# EAGLE design schematic (EAGLE 6.2)
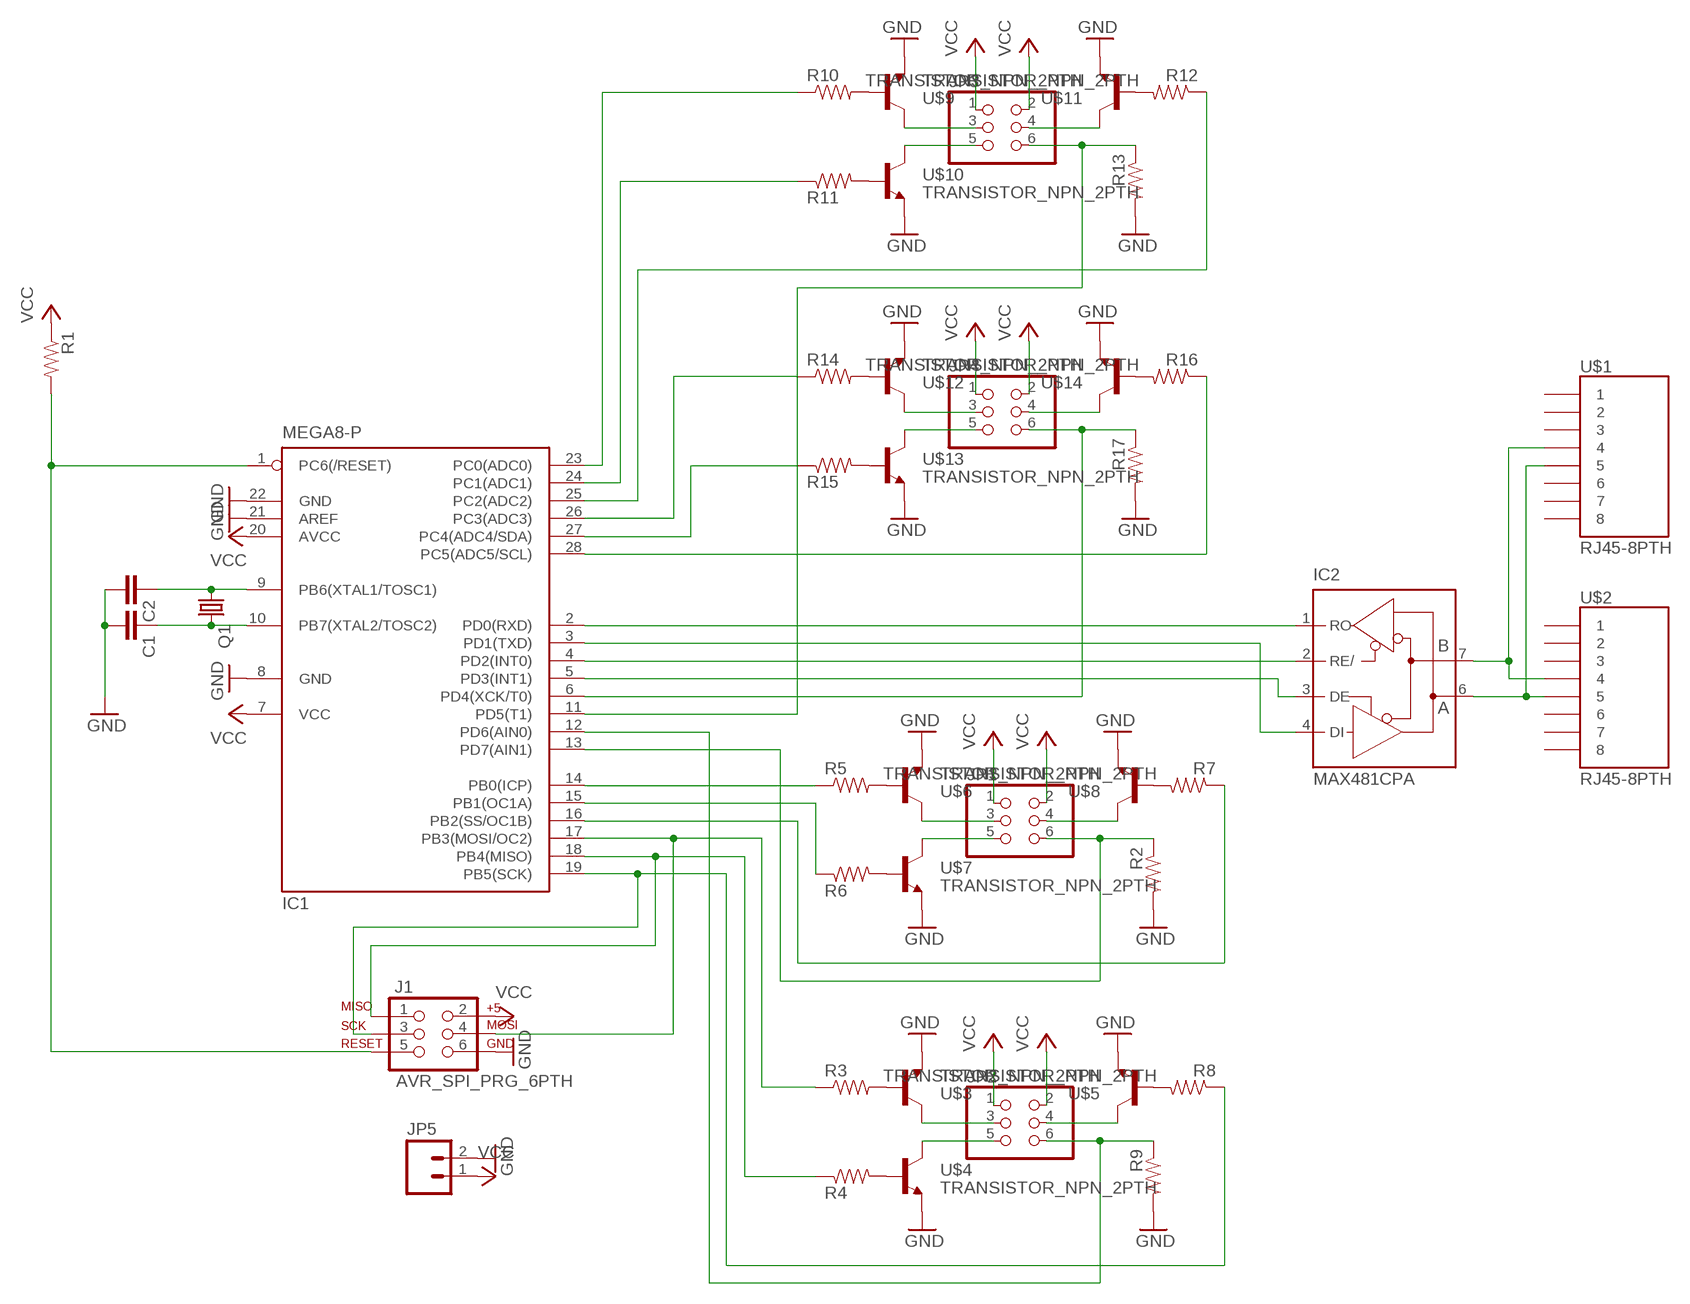
[diagram p0: schematic, sheet 1]

## Parts
C1  CAPKIT  [CAP-PTH-SMALL-KIT]
C2  CAPKIT  [CAP-PTH-SMALL-KIT]
IC1  MEGA8-P  [DIL28-3]
IC2  MAX481CPA  [DIL08]
J1  AVR_SPI_PRG_6PTH  [2X3]
JP1  PINHD-2X3  [2X03]
JP2  PINHD-2X3  [2X03]
JP3  PINHD-2X3  [2X03]
JP4  PINHD-2X3  [2X03]
JP5  M023.5MM  [SCREWTERMINAL-3.5MM-2]
Q1  CRYSTALHC49U-V  [HC49U-V]
R1  RESISTORPTH-1/4W  [AXIAL-0.4]
R2  RESISTORPTH-1/4W  [AXIAL-0.4]
R3  RESISTORPTH-1/4W  [AXIAL-0.4]
R4  RESISTORPTH-1/4W  [AXIAL-0.4]
R5  RESISTORPTH-1/4W  [AXIAL-0.4]
R6  RESISTORPTH-1/4W  [AXIAL-0.4]
R7  RESISTORPTH-1/4W  [AXIAL-0.4]
R8  RESISTORPTH-1/4W  [AXIAL-0.4]
R9  RESISTORPTH-1/4W  [AXIAL-0.4]
R10  RESISTORPTH-1/4W  [AXIAL-0.4]
R11  RESISTORPTH-1/4W  [AXIAL-0.4]
R12  RESISTORPTH-1/4W  [AXIAL-0.4]
R13  RESISTORPTH-1/4W  [AXIAL-0.4]
R14  RESISTORPTH-1/4W  [AXIAL-0.4]
R15  RESISTORPTH-1/4W  [AXIAL-0.4]
R16  RESISTORPTH-1/4W  [AXIAL-0.4]
R17  RESISTORPTH-1/4W  [AXIAL-0.4]
U$1  RJ45-8PTH  [RJ45-8]
U$2  RJ45-8PTH  [RJ45-8]
U$3  TRANSISTOR_NPN_2PTH  [TO-92]
U$4  TRANSISTOR_NPN_2PTH  [TO-92]
U$5  TRANSISTOR_NPN_2PTH  [TO-92]
U$6  TRANSISTOR_NPN_2PTH  [TO-92]
U$7  TRANSISTOR_NPN_2PTH  [TO-92]
U$8  TRANSISTOR_NPN_2PTH  [TO-92]
U$9  TRANSISTOR_NPN_2PTH  [TO-92]
U$10  TRANSISTOR_NPN_2PTH  [TO-92]
U$11  TRANSISTOR_NPN_2PTH  [TO-92]
U$12  TRANSISTOR_NPN_2PTH  [TO-92]
U$13  TRANSISTOR_NPN_2PTH  [TO-92]
U$14  TRANSISTOR_NPN_2PTH  [TO-92]

## Nets
GND: C1.2 C2.2 IC1.8(GND) IC1.21(AREF) IC1.22(GND) J1.6 JP5.2 R2.P$2 R9.P$2 R13.P$2 R17.P$2 U$3.3(E) U$4.3(E) U$5.3(E) U$6.3(E) U$7.3(E) U$8.3(E) U$9.3(E) U$10.3(E) U$11.3(E) U$12.3(E) U$13.3(E) U$14.3(E)
N$1: IC2.7(B) U$1.4 U$2.4
N$2: IC2.6(A) U$1.5 U$2.5
N$3: IC1.26(PC3(ADC3)) R14.P$1
N$4: C2.1 IC1.9(PB6(XTAL1/TOSC1)) Q1.1
N$5: C1.1 IC1.10(PB7(XTAL2/TOSC2)) Q1.2
N$6: JP1.3 U$6.1(C)
N$7: IC1.2(PD0(RXD)) IC2.1(RO)
N$8: IC1.3(PD1(TXD)) IC2.4(DI)
N$9: JP1.5 U$7.1(C)
N$10: JP1.4 U$8.1(C)
N$11: IC1.27(PC4(ADC4/SDA)) R15.P$1
N$12: IC1.14(PB0(ICP)) R5.P$1
N$13: IC1.15(PB1(OC1A)) R6.P$1
N$14: IC1.13(PD7(AIN1)) JP1.6 R2.P$1
N$16: IC1.5(PD3(INT1)) IC2.3(DE)
N$17: R5.P$2 U$6.2(B)
N$18: IC1.1(PC6(/RESET)) J1.5 R1.P$2
N$19: R6.P$2 U$7.2(B)
N$20: R7.P$2 U$8.2(B)
N$21: IC1.12(PD6(AIN0)) JP2.6 R9.P$1
N$22: IC1.4(PD2(INT0)) IC2.2(RE/)
N$23: R3.P$2 U$3.2(B)
N$24: R4.P$2 U$4.2(B)
N$25: R8.P$2 U$5.2(B)
N$26: IC1.19(PB5(SCK)) J1.3 R8.P$1
N$27: IC1.16(PB2(SS/OC1B)) R7.P$1
N$28: JP2.3 U$3.1(C)
N$29: JP2.5 U$4.1(C)
N$30: JP2.4 U$5.1(C)
N$31: IC1.11(PD5(T1)) JP3.6 R13.P$1
N$32: R10.P$2 U$9.2(B)
N$33: R11.P$2 U$10.2(B)
N$34: R12.P$2 U$11.2(B)
N$35: IC1.24(PC1(ADC1)) R11.P$1
N$36: IC1.25(PC2(ADC2)) R12.P$1
N$39: JP3.3 U$9.1(C)
N$40: JP3.5 U$10.1(C)
N$41: JP3.4 U$11.1(C)
N$42: IC1.6(PD4(XCK/T0)) JP4.6 R17.P$1
N$43: R14.P$2 U$12.2(B)
N$45: R15.P$2 U$13.2(B)
N$47: R16.P$2 U$14.2(B)
N$48: IC1.23(PC0(ADC0)) R10.P$1
N$50: IC1.28(PC5(ADC5/SCL)) R16.P$1
N$51: JP4.3 U$12.1(C)
N$52: JP4.5 U$13.1(C)
N$53: JP4.4 U$14.1(C)
N$54: IC1.17(PB3(MOSI/OC2)) J1.4 R3.P$1
N$55: IC1.18(PB4(MISO)) J1.1 R4.P$1
VCC: IC1.7(VCC) IC1.20(AVCC) J1.2 JP1.1 JP1.2 JP2.1 JP2.2 JP3.1 JP3.2 JP4.1 JP4.2 JP5.1 R1.P$1
Unconnected: U$1.1 U$1.2 U$1.3 U$1.6 U$1.7 U$1.8 U$2.1 U$2.2 U$2.3 U$2.6 U$2.7 U$2.8

## Power pins joined to a net without a drawn wire
GND: IC2.5(GND)
VCC: IC2.8(VCC)

## Library data of the parts
C1 C2 = SparkFun-Passives:CAP: Capacitor Standard 0603 ceramic capacitor, and 0.1" leaded capacitor.
IC1 = atmel:MEGA8-P: MICROCONTROLLER 8 Kbytes FLASH, 1 kbytes SRAM, 512 bytes EEPROM, USART, 4-channel 10 bit ADC, 2-channel 8 bit ADC Pin compatible with Atmega48, ATMega88, ATMega168 Source: avr.lbr; OC_FARNELL: unknown; OC_NEWARK: unknown
IC2 = maxim:MAX481CPA: RS485 TRANSEIVER; MPN: MAX481CPA+; OC_FARNELL: unknown; OC_NEWARK: 99K3445
J1 = SparkFun-Connectors:AVR_SPI_PRG_6: AVR ISP 6 Pin This is the reduced ISP connector for AVR programming. Common on Arduino. This footprint will take up less PCB space and can be used with a 10-pin to 6-pin adapter such as SKU: BOB-08508
JP1-JP4 = SparkFun-Connectors:PINHD-2X3: PIN HEADER
JP5 = SparkFun-Connectors:M02: Header 2 Standard 2-pin 0.1" header. Use with straight break away headers (SKU : PRT-00116), right angle break away headers (PRT-00553), swiss pins (PRT-00743), machine pins (PRT-00117), and female headers (PRT-00115). Molex polarized connector foot print use with SKU : PRT-08233 with associated crimp pins and housings.
Q1 = crystal:CRYSTAL: CRYSTAL; OC_FARNELL: 1666969; OC_NEWARK: unknown
R1-R17 = SparkFun-Passives:RESISTOR: Resistor Basic schematic elements and footprints for 0603, 1206, and PTH resistors.
U$1 U$2 = SparkFun-Connectors:RJ45-8: RJ45 Jack Simple RJ45, 8-pin connection - connector for common Cat5, Cat5e, and Cat6 Ethernet cables. Footprint not yet proven in production. Connector sku is PRT-00643; Breakout PCB sku is BOB-00716.
U$3-U$14 = SparkFun-DiscreteSemi:TRANSISTOR_NPN_2: Alternate TO-92 NPN BJT

## Board
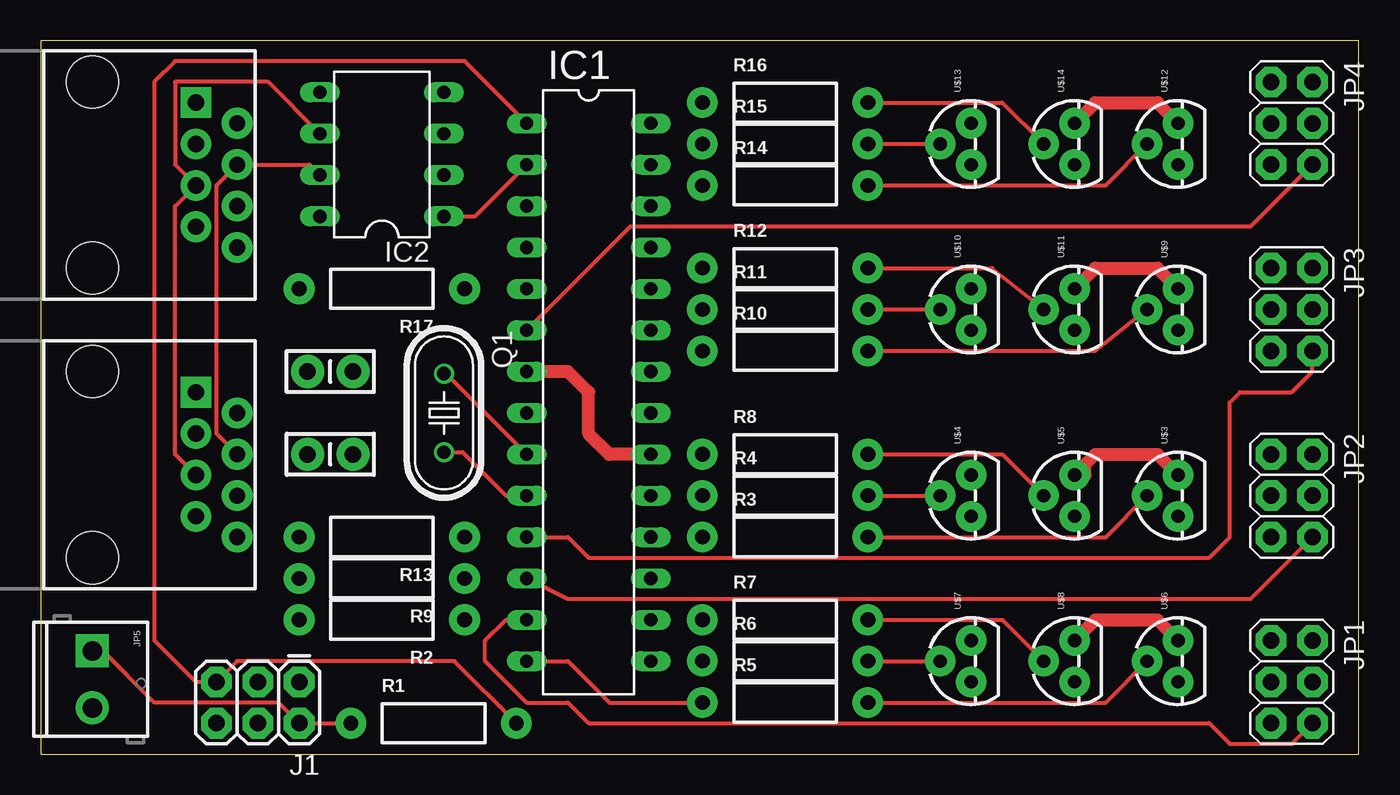
[diagram p1: board, top side]
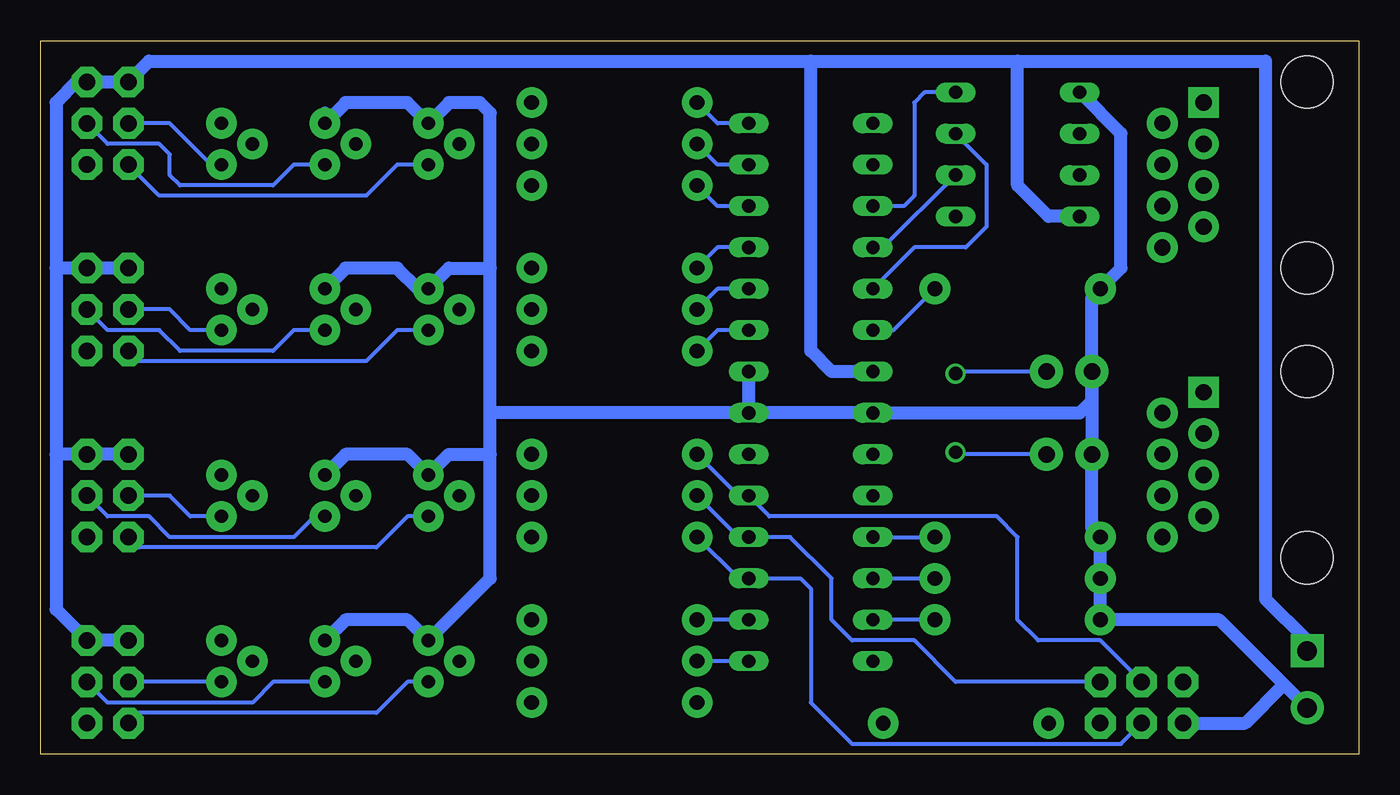
[diagram p2: board, bottom side, seen from below]

Size 80.95 x 43.8 mm. Coordinates in mm from the lower left corner, seen from the top.
Outline: 0,0 80.95,0 80.95,43.8 0,43.8 0,0
Copper layers (1*16): Top 0.0356mm / dielectric 1.5011mm / Bottom 0.0356mm
Design rules: minimum track width 6mil, minimum drill 13mil, track to track 6mil, track to pad 6mil, pad to pad 6mil, via to via 6mil, smd to smd 6mil, copper to edge 15mil, drill to drill 6mil, minimum pad ring 7mil, minimum via ring 7mil, stop-mask expansion 4mil, vias tented up to drill 0mil, thermal gap 10mil

### Footprints (pad centres in the part's own frame; a part is rotated, then mirrored left to right if it is on the bottom)
CAP-PTH-SMALL-KIT = drill 1.016 pad 2.032: 1 -1.397,0; 2 1.397,0
DIL28-3 = drill 0.813 long: 1 -16.51,-3.81; 2 -13.97,-3.81; 3 -11.43,-3.81; 4 -8.89,-3.81; 5 -6.35,-3.81; 6 -3.81,-3.81; 7 -1.27,-3.81; 8 1.27,-3.81; 9 3.81,-3.81; 10 6.35,-3.81; 11 8.89,-3.81; 12 11.43,-3.81; 13 13.97,-3.81; 14 16.51,-3.81; 15 16.51,3.81; 16 13.97,3.81; 17 11.43,3.81; 18 8.89,3.81; 19 6.35,3.81; 20 3.81,3.81; 21 1.27,3.81; 22 -1.27,3.81; 23 -3.81,3.81; 24 -6.35,3.81; 25 -8.89,3.81; 26 -11.43,3.81; 27 -13.97,3.81; 28 -16.51,3.81
DIL08 = drill 0.813 long: 1 -3.81,-3.81; 2 -1.27,-3.81; 3 1.27,-3.81; 4 3.81,-3.81; 5 3.81,3.81; 6 1.27,3.81; 7 -1.27,3.81; 8 -3.81,3.81
2X3 = drill 1.016 pad 1.88 octagon: 1 0,0; 2 0,2.54; 3 2.54,0; 4 2.54,2.54; 5 5.08,0; 6 5.08,2.54
2X03 = drill 1.016 pad 1.88 octagon: 1 -2.54,-1.27; 2 -2.54,1.27; 3 0,-1.27; 4 0,1.27; 5 2.54,-1.27; 6 2.54,1.27
SCREWTERMINAL-3.5MM-2 = drill 1.2 pad 2.032 square: 1 0,0 | drill 1.2 pad 2.032: 2 3.5,0
HC49U-V = drill 0.813: 1 -2.413,0; 2 2.413,0
AXIAL-0.4 = drill 0.9 pad 1.88: P$1 -5.08,0; P$2 5.08,0
RJ45-8 = drill 1 pad 1.88 square: 1 -4.445,6.35 | drill 1 pad 1.88: 2 -3.175,8.89; 3 -1.905,6.35; 4 -0.635,8.89; 5 0.635,6.35; 6 1.905,8.89; 7 3.175,6.35; 8 4.445,8.89 | hole 3.2: -5.715,0; 5.715,0
TO-92 = drill 0.813 pad 1.88: 1 -1.27,0; 2 0,1.905; 3 1.27,0

### Placement (x,y rotation side)
C1  17.78,18.41 180 top
C2  17.78,23.49 180 top
IC1  33.66,22.23 270 top
IC2  20.95,36.83 90 top
J1  15.88,4.45 180 top
JP1  76.83,4.45 270 top
JP2  76.83,15.88 270 top
JP3  76.83,27.3 270 top
JP4  76.83,38.73 270 top
JP5  3.18,6.35 270 top
Q1  24.77,20.95 270 top
R1  24.13,1.91 0 top
R2  20.95,8.26 180 top
R3  45.72,13.34 0 top
R4  45.72,15.88 0 top
R5  45.72,3.18 0 top
R6  45.72,5.71 0 top
R7  45.72,8.26 0 top
R8  45.72,18.41 0 top
R9  20.95,10.8 180 top
R10  45.72,24.77 0 top
R11  45.72,27.3 0 top
R12  45.72,29.84 0 top
R13  20.95,13.34 180 top
R14  45.72,34.92 0 top
R15  45.72,37.46 0 top
R16  45.72,40 0 top
R17  20.95,28.58 180 top
U$1  3.18,35.56 270 top
U$2  3.18,17.78 270 top
U$3  69.85,15.88 90 top
U$4  57.15,15.88 90 top
U$5  63.5,15.88 90 top
U$6  69.85,5.71 90 top
U$7  57.15,5.71 90 top
U$8  63.5,5.71 90 top
U$9  69.85,27.3 90 top
U$10  57.15,27.3 90 top
U$11  63.5,27.3 90 top
U$12  69.85,37.46 90 top
U$13  57.15,37.46 90 top
U$14  63.5,37.46 90 top

### Tracks (layer width: path | path; a pad name or v marks a point on that pad's centre or on a via)
GND
  Top 0.813: U$11.3 64.77,29.84 68.58,29.84 U$9.3 | U$14.3 64.77,40 68.58,40 U$12.3 | U$5.3 64.14,17.14 64.14,17.78 64.77,18.41 68.58,18.41 U$3.3 | U$8.3 64.77,8.26 68.58,8.26 U$6.3
  Bottom 0.254: 16.38,28.07 R17.P$2
  Bottom 0.813: IC1.21 IC1.8 17.15,20.95 16.38,21.72 C2.2 | U$11.3 62.23,29.84 59.05,29.84 57.78,28.58 U$10.3 55.88,29.84 53.34,29.84 | 63.5,39.37 U$14.3 62.23,40 58.42,40 U$13.3 55.88,40 53.97,40 53.34,39.37 53.34,29.84 | U$5.3 62.23,18.41 58.42,18.41 U$4.3 55.88,18.41 53.34,18.41 | IC1.21 53.34,20.95 | 53.34,20.95 53.34,29.84 | 53.34,18.41 53.34,10.8 U$7.3 58.42,8.26 62.23,8.26 U$8.3 | 53.34,18.41 53.34,20.95 | IC1.21 IC1.22 | C2.2 16.38,28.07 | R17.P$2 14.6,29.84 14.6,38.1 IC2.5 | JP5.2 4.61,4.28 | 4.61,4.28 8.58,8.26 R2.P$2 R9.P$2 R13.P$2 16.38,13.84 C1.2 C2.2 | J1.6 6.99,1.91 4.61,4.28
N$1
  Top 0.254: U$2.4 10.79,19.69 10.79,34.92 U$1.4 16.51,36.2 IC2.7
N$2
  Top 0.254: U$2.5 8.26,18.41 8.26,33.66 U$1.5 8.26,36.2 8.26,41.28 13.97,41.28 IC2.6
N$3
  Bottom 0.254: IC1.26 39.37,33.66 R14.P$1
N$4
  Top 0.254: Q1.1 24.89,23.37 IC1.9
  Bottom 0.254: C2.1 24.64,23.49 Q1.1
N$5
  Top 0.254: Q1.2 25.91,18.54 28.57,15.88 IC1.10
  Bottom 0.254: C1.1 24.64,18.41 Q1.2
N$6
  Bottom 0.254: U$6.1 JP1.3
N$7
  Top 0.254: IC2.1 26.67,33.02 IC1.2
N$8
  Bottom 0.254: IC2.4 26.67,40.64 27.3,40 27.3,34.29 27.94,33.66 IC1.3
N$9
  Bottom 0.254: U$7.1 58.42,4.45 60.33,2.54 74.93,2.54 JP1.5
N$10
  Bottom 0.254: U$8.1 66.67,4.45 67.94,3.18 76.83,3.18 JP1.4
N$11
  Bottom 0.254: IC1.27 39.37,36.2 R15.P$1
N$12
  Top 0.254: IC1.14 32.38,5.71 34.92,3.18 R5.P$1
N$13
  Bottom 0.254: IC1.15 R6.P$1
N$14
  Top 0.254: JP1.6 76.83,0.63 73.02,0.63 71.75,1.91 33.66,1.91 32.38,3.18 29.84,3.18 27.3,5.71 27.3,6.98 28.57,8.26 IC1.13
  Bottom 0.254: R2.P$1 IC1.13
N$16
  Bottom 0.254: IC2.3 22.86,36.2 22.86,32.38 24.13,31.12 27.3,31.12 IC1.5
N$17
  Top 0.254: R5.P$2 65.41,3.18 U$6.2
N$18
  Top 0.254: IC1.1 26.03,42.55 8.26,42.55 6.99,41.28 6.99,6.98 9.53,4.45 J1.5 12.06,5.71 25.4,5.71 R1.P$2
N$19
  Top 0.254: R6.P$2 U$7.2
N$20
  Top 0.254: R7.P$2 59.05,8.26 U$8.2
N$21
  Top 0.254: JP2.6 74.3,9.52 32.38,9.52 IC1.12
  Bottom 0.254: IC1.12 R9.P$1
N$22
  Bottom 0.254: IC2.2 29.21,31.12 IC1.4
N$23
  Top 0.254: R3.P$2 65.41,13.34 U$3.2
N$24
  Top 0.254: R4.P$2 U$4.2
N$25
  Top 0.254: R8.P$2 59.05,18.41 U$5.2
N$26
  Bottom 0.254: R8.P$1 38.1,15.88 IC1.19 36.2,14.6 22.23,14.6 20.95,13.34 20.95,8.26 19.69,6.98 15.88,6.98 J1.3
N$27
  Bottom 0.254: IC1.16 R7.P$1
N$28
  Bottom 0.254: U$3.1 71.75,14.6 73.02,15.88 JP2.3
N$29
  Bottom 0.254: U$4.1 58.42,14.6 60.33,12.7 74.93,12.7 JP2.5
N$30
  Bottom 0.254: U$5.1 64.14,14.6 65.41,13.34 73.02,13.34 74.3,14.6 76.83,14.6 JP2.4
N$31
  Top 0.254: IC1.11 32.38,13.34 33.66,12.06 71.75,12.06 73.02,13.34 73.02,21.59 73.66,22.23 76.83,22.23 78.11,23.49 JP3.6
  Bottom 0.254: IC1.11 R13.P$1
N$32
  Top 0.254: R10.P$2 64.77,24.77 U$9.2
N$33
  Top 0.254: R11.P$2 U$10.2
N$34
  Top 0.254: R12.P$2 58.42,29.84 U$11.2
N$35
  Bottom 0.254: IC1.24 39.37,28.58 R11.P$1
N$36
  Bottom 0.254: IC1.25 39.37,31.12 R12.P$1
N$39
  Bottom 0.254: U$9.1 71.75,26.03 73.02,27.3 JP3.3
N$40
  Bottom 0.254: U$10.1 59.05,26.03 60.96,24.13 74.93,24.13 JP3.5
N$41
  Bottom 0.254: U$11.1 65.41,26.03 66.67,24.77 72.39,24.77 73.66,26.03 76.83,26.03 JP3.4
N$42
  Top 0.254: JP4.6 74.3,32.38 36.2,32.38 IC1.6
  Bottom 0.254: IC1.6 28.57,26.03 R17.P$1
N$43
  Top 0.254: R14.P$2 65.41,34.92 U$12.2
N$45
  Top 0.254: R15.P$2 U$13.2
N$47
  Top 0.254: R16.P$2 59.05,40 U$14.2
N$48
  Bottom 0.254: IC1.23 39.37,26.03 R10.P$1
N$50
  Bottom 0.254: IC1.28 39.37,38.73 R16.P$1
N$51
  Bottom 0.254: U$12.1 70.48,36.2 73.02,38.73 JP4.3
N$52
  Bottom 0.254: U$13.1 59.05,36.2 60.96,34.29 73.66,34.29 JP4.5
N$53
  Bottom 0.254: U$14.1 65.41,36.2 66.67,34.92 72.39,34.92 73.02,35.56 73.02,36.83 73.66,37.46 76.83,37.46 JP4.4
N$54
  Bottom 0.254: R3.P$1 38.1,10.8 IC1.17 34.29,10.8 33.66,10.16 33.66,3.18 31.11,0.63 14.6,0.63 J1.4
N$55
  Bottom 0.254: R4.P$1 38.1,13.34 IC1.18 34.92,13.34 32.38,10.8 32.38,8.26 31.11,6.98 27.3,6.98 24.77,4.45 J1.1
VCC
  Top 0.254: JP5.1 3.81,6.35 6.99,3.18 14.6,3.18 J1.2 R1.P$1
  Top 0.813: IC1.20 34.92,18.41 33.66,19.69 33.66,22.23 32.38,23.49 IC1.7
  Bottom 0.813: JP1.1 JP1.2 80.01,8.89 80.01,18.41 | JP2.1 JP2.2 80.01,18.41 | JP3.1 JP3.2 80.01,29.84 | 33.66,42.55 74.3,42.55 JP4.1 JP4.2 78.74,41.28 80.01,40 80.01,29.84 | 33.66,42.55 20.95,42.55 | 20.95,42.55 5.72,42.55 5.72,9.52 3.18,6.98 JP5.1 | 80.01,29.84 80.01,18.41 | IC1.7 32.38,23.49 33.66,24.77 33.66,42.55 | IC2.8 19.05,33.02 20.95,34.92 20.95,42.55